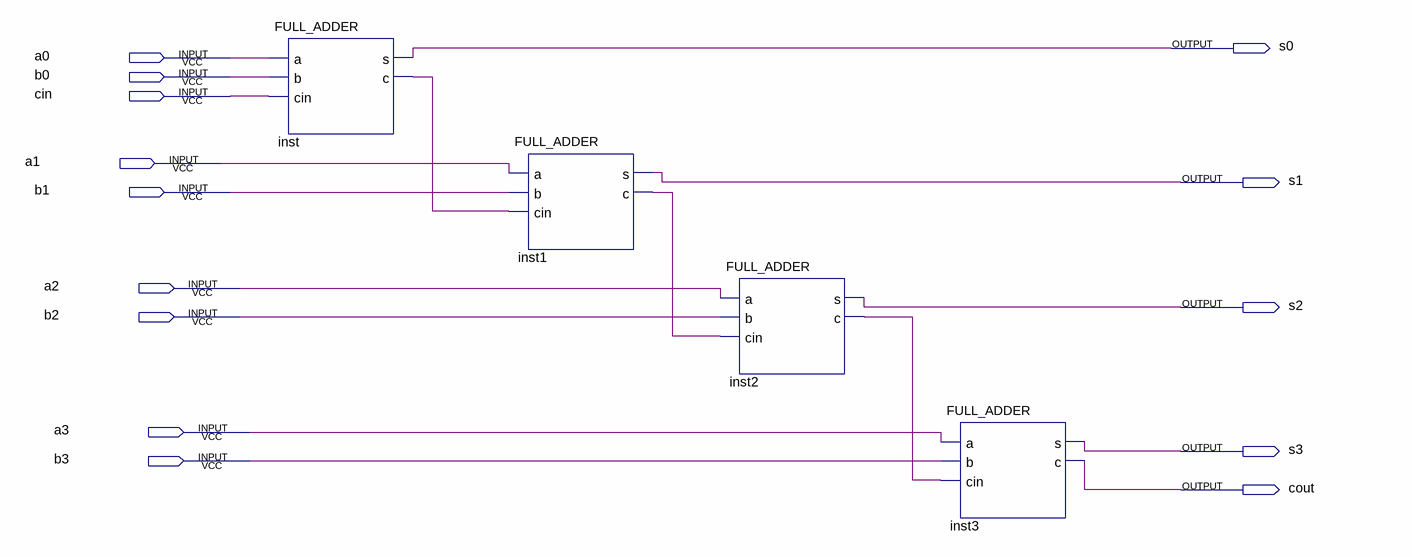
[diagram p0: schematic sheet]
// Quartus schematic full_adder_4b.bdf as structural Verilog: 4 symbols, 14 pins
module full_adder_4b (
  input  a0,
  input  b0,
  input  cin,
  input  a1,
  input  b1,
  input  a2,
  input  b2,
  input  a3,
  input  b3,
  output s0,
  output s1,
  output s2,
  output s3,
  output cout
);

  wire inst1_c, inst2_c, inst_c;

  FULL_ADDER inst (.a(a0), .b(b0), .cin(cin), .s(s0), .c(inst_c));
  FULL_ADDER inst1 (.a(a1), .b(b1), .cin(inst_c), .s(s1), .c(inst1_c));
  FULL_ADDER inst2 (.a(a2), .b(b2), .cin(inst1_c), .s(s2), .c(inst2_c));
  FULL_ADDER inst3 (.a(a3), .b(b3), .cin(inst2_c), .s(s3), .c(cout));
endmodule
